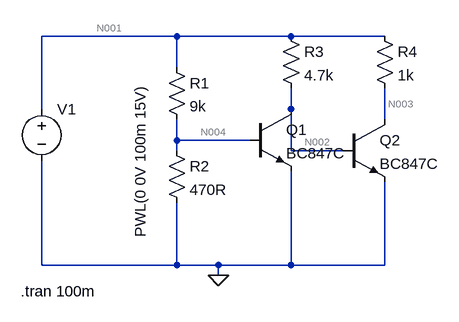
[diagram p0: schematic Draft2.asc]
Draft2.asc, the LTspice schematic file:
Version 4.1
SHEET 1 880 680
WIRE 208 32 0 32
WIRE 384 32 208 32
WIRE 528 32 384 32
WIRE 208 80 208 32
WIRE 0 144 0 32
WIRE 384 144 384 112
WIRE 528 160 528 112
WIRE 208 192 208 160
WIRE 320 192 208 192
WIRE 208 208 208 192
WIRE 384 208 384 144
WIRE 464 208 384 208
WIRE 0 384 0 224
WIRE 208 384 208 288
WIRE 208 384 0 384
WIRE 272 384 208 384
WIRE 384 384 384 240
WIRE 384 384 272 384
WIRE 528 384 528 256
WIRE 528 384 384 384
WIRE 272 400 272 384
FLAG 272 400 0
SYMBOL voltage 0 128 R0
WINDOW 3 136 96 VTop 2
WINDOW 123 0 0 Left 0
WINDOW 39 0 0 Left 0
SYMATTR Value PWL(0 0V 100m 15V)
SYMATTR InstName V1
SYMBOL res 192 64 R0
SYMATTR InstName R1
SYMATTR Value 9k
SYMBOL res 192 192 R0
SYMATTR InstName R2
SYMATTR Value 470R
SYMBOL res 368 16 R0
SYMATTR InstName R3
SYMATTR Value 4.7k
SYMBOL res 512 16 R0
SYMATTR InstName R4
SYMATTR Value 1k
SYMBOL npn 320 144 R0
SYMATTR InstName Q1
SYMATTR Value BC847C
SYMBOL npn 464 160 R0
SYMATTR InstName Q2
SYMATTR Value BC847C
TEXT -32 424 Left 2 !.tran 100m

The netlist it stands for:
* Draft2.asc
V1 N001 0 PWL(0 0V 100m 15V)
R1 N001 N004 9k
R2 N004 0 470R
R3 N001 N002 4.7k
R4 N001 N003 1k
Q1 N002 N004 0 0 BC847C
Q2 N003 N002 0 0 BC847C
.model NPN NPN
.model PNP PNP
.lib standard.bjt
.tran 100m
.backanno
.end

* Results of the author's LTspice run, read from the files saved beside the schematic
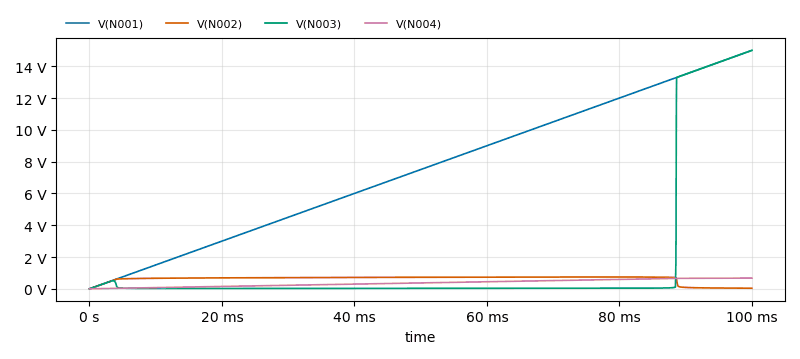
[diagram p1: Transient Analysis of Draft2.asc, plotted from the saved traces]
* Transient Analysis, 1 run:
*   V(N001): min 0 V, max 15 V, average 7.5 V, rms 8.667 V, last 15 V
*   V(N002): min 0 V, max 744.1 mV, average 622.3 mV, rms 660.4 mV, last 37.4 mV
*   V(N003): min 0 V, max 15 V, average 1.653 V, rms 4.782 V, last 15 V
*   V(N004): min 0 V, max 673.3 mV, average 368.1 mV, rms 423.4 mV, last 673.3 mV